# Altium schematic sheet 03-DRAM_Memory.SchDoc
size A4; Author: Fabian Castaño; CompanyName: GIBIC Tech-Hub; Engineer: Fabian Castaño; Organization: Universidad de Antioquia; Address1: UdeA; Address2: Medellín; Address3: Antioquia; Address4: Colombia 050010
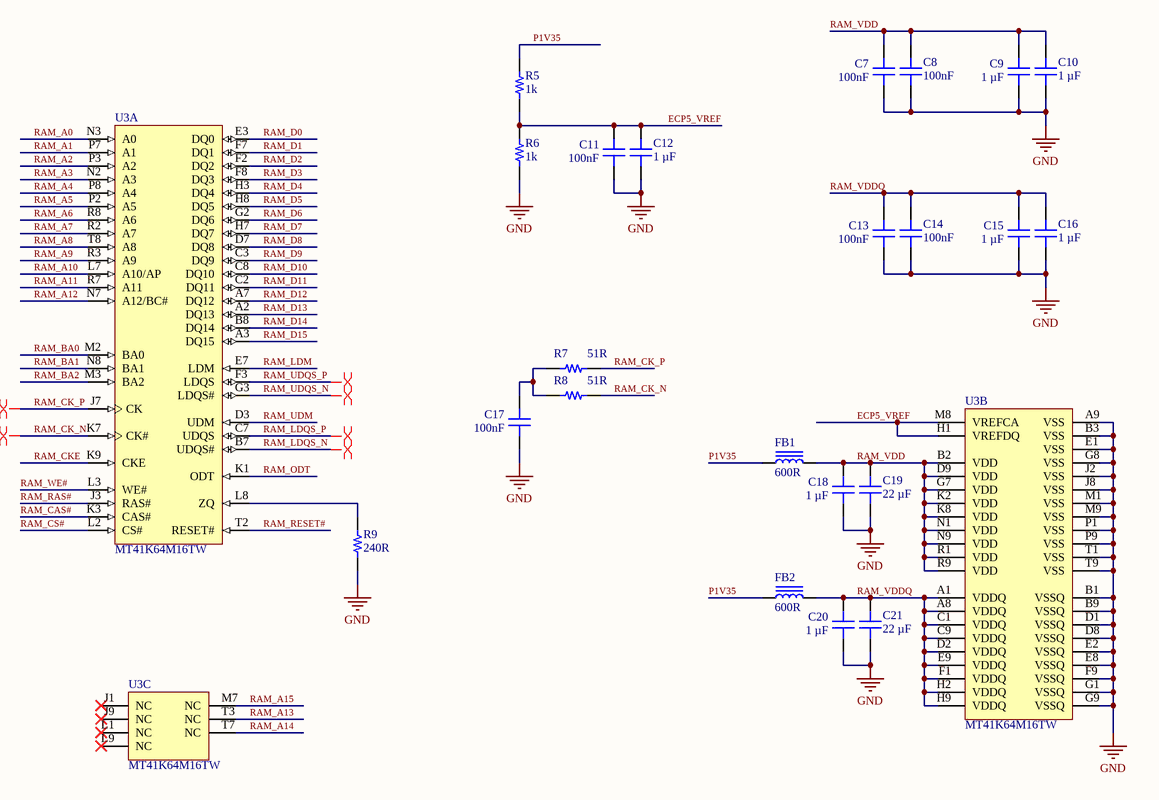
[diagram p0: 03-DRAM_Memory.SchDoc]

## Parts
C7  100nF  [CAP 0201_0603]
C8  100nF  [CAP 0201_0603]
C9  1 µF  [CAP 0402_1005]
C10  1 µF  [CAP 0402_1005]
C11  100nF  [CAP 0201_0603]
C12  1 µF  [CAP 0402_1005]
C13  100nF  [CAP 0201_0603]
C14  100nF  [CAP 0201_0603]
C15  1 µF  [CAP 0402_1005]
C16  1 µF  [CAP 0402_1005]
C17  100nF  [CAP 0201_0603]
C18  1 µF  [CAP 0402_1005]
C19  22 µF  [CAP 0603_1608]
C20  1 µF  [CAP 0402_1005]
C21  22 µF  [CAP 0603_1608]
FB1  600R  [IND 0402_1005 RF WW]
FB2  600R  [IND 0402_1005 RF WW]
R5  1k  [RES 0201_0603]
R6  1k  [RES 0201_0603]
R7  51R  [RES 0201_0603]
R8  51R  [RES 0201_0603]
R9  240R  [RES 0402_1005]
U3  MT41K64M16TW  [MICT-TW-96]  (parts A,B,C of 3)

## Nets
GND: C7.1 C8.1 C9.1 C10.1 C11.1 C12.1 C13.1 C14.1 C15.1 C16.1 C17.1 C18.1 C19.1 C20.1 C21.1 R6.2 R9.1 U3.A9(VSS) U3.B1(VSSQ) U3.B3(VSS) U3.B9(VSSQ) U3.D1(VSSQ) U3.D8(VSSQ) U3.E1(VSS) U3.E2(VSSQ) U3.E8(VSSQ) U3.F9(VSSQ) U3.G1(VSSQ) U3.G8(VSS) U3.G9(VSSQ) U3.J2(VSS) U3.J8(VSS) U3.M1(VSS) U3.M9(VSS) U3.P1(VSS) U3.P9(VSS) U3.T1(VSS) U3.T9(VSS)
ECP5_VREF: C11.2 C12.2 R5.2 R6.1 U3.H1(VREFDQ) U3.M8(VREFCA)
P1V35: FB1.1 FB2.1 R5.1
RAM_A0: U3.N3(A0)
RAM_A1: U3.P7(A1)
RAM_A2: U3.P3(A2)
RAM_A3: U3.N2(A3)
RAM_A4: U3.P8(A4)
RAM_A5: U3.P2(A5)
RAM_A6: U3.R8(A6)
RAM_A7: U3.R2(A7)
RAM_A8: U3.T8(A8)
RAM_A9: U3.R3(A9)
RAM_A10: U3.L7(A10/AP)
RAM_A11: U3.R7(A11)
RAM_A12: U3.N7(A12/BC#)
RAM_A13: U3.T3(NC)
RAM_A14: U3.T7(NC)
RAM_A15: U3.M7(NC)
RAM_BA0: U3.M2(BA0)
RAM_BA1: U3.N8(BA1)
RAM_BA2: U3.M3(BA2)
RAM_CAS#: U3.K3(CAS#)
RAM_CK_N: R8.2 U3.K7(CK#)
RAM_CK_P: R7.2 U3.J7(CK)
RAM_CKE: U3.K9(CKE)
RAM_CS#: U3.L2(CS#)
RAM_D0: U3.E3(DQ0)
RAM_D1: U3.F7(DQ1)
RAM_D2: U3.F2(DQ2)
RAM_D3: U3.F8(DQ3)
RAM_D4: U3.H3(DQ4)
RAM_D5: U3.H8(DQ5)
RAM_D6: U3.G2(DQ6)
RAM_D7: U3.H7(DQ7)
RAM_D8: U3.D7(DQ8)
RAM_D9: U3.C3(DQ9)
RAM_D10: U3.C8(DQ10)
RAM_D11: U3.C2(DQ11)
RAM_D12: U3.A7(DQ12)
RAM_D13: U3.A2(DQ13)
RAM_D14: U3.B8(DQ14)
RAM_D15: U3.A3(DQ15)
RAM_LDM: U3.E7(LDM)
RAM_LDQS_N: U3.B7(UDQS#)
RAM_LDQS_P: U3.C7(UDQS)
RAM_ODT: U3.K1(ODT)
RAM_RAS#: U3.J3(RAS#)
RAM_RESET#: U3.T2(RESET#)
RAM_UDM: U3.D3(UDM)
RAM_UDQS_N: U3.G3(LDQS#)
RAM_UDQS_P: U3.F3(LDQS)
RAM_VDD: C7.2 C8.2 C9.2 C10.2 C18.2 C19.2 FB1.2 U3.B2(VDD) U3.D9(VDD) U3.G7(VDD) U3.K2(VDD) U3.K8(VDD) U3.N1(VDD) U3.N9(VDD) U3.R1(VDD) U3.R9(VDD)
RAM_VDDQ: C13.2 C14.2 C15.2 C16.2 C20.2 C21.2 FB2.2 U3.A1(VDDQ) U3.A8(VDDQ) U3.C1(VDDQ) U3.C9(VDDQ) U3.D2(VDDQ) U3.E9(VDDQ) U3.F1(VDDQ) U3.H2(VDDQ) U3.H9(VDDQ)
RAM_WE#: U3.L3(WE#)
NetC17_2: C17.2 R7.1 R8.1
NetR9_2: R9.2 U3.L8(ZQ)

Not connected (* = marked no-connect by the designer): U3 J1(NC)* J9(NC)* L1(NC)* L9(NC)*

## Layout directives
differential pair: RAM_CK_N, RAM_CK_P, RAM_LDQS_N, RAM_LDQS_P, RAM_UDQS_N, RAM_UDQS_P

## Notes on the sheet
- Title
- Size:
- Date:
- A4
- Enginner:
- Time:
- Revision:
- Sheet
- of
- Author:
- File:

## Library data of the parts
C7 C8 C11 C13 C14 C17 = GRT033C80J104KE01J: CAP CER 0.1UF 6.3V X6S 0201; manufacturer: Murata Electronics; Capacitance: 0.1 µF; Tolerance: ±10%; Part Number: GRT033C80J104KE01J; Value: 100nF; Applications: Automotive; componentlink1description: Datasheet; componentlink1url: https://search.murata.co.jp/Ceramy/image/img/A01X/G101/ENG/GRT033C80J104KE01-01.pdf; componentlink2description: DigiKey Link; componentlink2url: https://www.digikey.com/en/products/detail/murata-electronics/GRT033C80J104KE01J/13905086; Device Package: 0201 (0603 Metric); lastupdated: 3/01/2023 8:00:58 p. m.; Lifecycle Status: Active; Minimum Order: 1; Mounting Type: Surface Mount, MLCC; Operating Temperature: -55°C ~ 105°C; Package / Case: 0201 (0603 Metric); packaging: CutTape; partid: 29730; Part Status: Active; price: 0.01; Ratings: AEC-Q200; series: GRT; Size / Dimension: 0.024" L x 0.012" W (0.60mm x 0.30mm); Supplier 1: DigiKey; Supplier Part Number 1: 490-GRT033C80J104KE01JCT-ND; Temperature Coefficient: X6S; Thickness (Max): 0.013" (0.33mm); Voltage - Rated: 6.3V
C9 C10 C12 C15 C16 C18 C20 = LMK105C6105KV-F: CAP CER 1UF 10V X6S 0402; manufacturer: Taiyo Yuden; Tolerance: ±10%; Part Number: LMK105C6105KV-F; Value: 1 µF; Applications: SMPS Filtering; Capacitance: 1 µF; componentlink1description: Datasheet; componentlink1url: https://www.yuden.co.jp/productdata/catalog/mlcc01_e.pdf; componentlink2description: DigiKey Link; componentlink2url: https://www.digikey.com/en/products/detail/taiyo-yuden/LMK105C6105KV-F/4157226; Device Package: 0402 (1005 Metric); lastupdated: 3/01/2023 8:04:17 p. m.; Lifecycle Status: Active; Minimum Order: 1; Mounting Type: Surface Mount, MLCC; Operating Temperature: -55°C ~ 105°C; Package / Case: 0402 (1005 Metric); packaging: TapeAndReel; partid: 2215; Part Status: Active; price: 0.01; series: M; Size / Dimension: 0.039" L x 0.020" W (1.00mm x 0.50mm); Supplier 1: DigiKey; Supplier Part Number 1: 587-3409-1-ND; Temperature Coefficient: X6S; Thickness (Max): 0.022" (0.55mm); Voltage - Rated: 10V
C19 C21 = GRM186R60J226ME15D: CAP CER 22UF 6.3V X5R 0603; manufacturer: Murata Electronics; Tolerance: ±20%; Part Number: GRM186R60J226ME15D; Value: 22 µF; Applications: General Purpose; Capacitance: 22 µF; componentlink1description: Datasheet; componentlink1url: https://psearch.en.murata.com/capacitor/product/GRM186R60J226ME15%23.pdf; componentlink2description: DigiKey Link; componentlink2url: https://www.digikey.com/en/products/detail/murata-electronics/GRM186R60J226ME15D/5877404; Device Package: 0603 (1608 Metric); lastupdated: 3/01/2023 8:07:48 p. m.; Lifecycle Status: Active; Minimum Order: 1; Mounting Type: Surface Mount, MLCC; Operating Temperature: -55°C ~ 85°C; Package / Case: 0603 (1608 Metric); packaging: TapeAndReel; partid: 2353; Part Status: Active; price: 0.06; series: GRM; Size / Dimension: 0.063" L x 0.031" W (1.60mm x 0.80mm); Supplier 1: DigiKey; Supplier Part Number 1: 490-13241-1-ND; Temperature Coefficient: X5R; Thickness (Max): 0.024" (0.60mm); Voltage - Rated: 6.3V
FB1 FB2 = LQW15AN4N8D8ZD: FIXED IND 4.8NH 1.2A 71MOHM SMD; Manufacturer: Murata Electronics; DC Resistance (DCR): 71mOhm Max; Frequency - Self Resonant: 8GHz; Inductance Frequency - Test: 100 MHz; Material - Core: Non-Magnetic; Q @ Freq: 30 @ 250MHz; Shielding: Unshielded; Tolerance: ±0.5nH; Type: Wirewound; Part Number: LQW15AN4N8D8ZD; ComponentLink1Description: Datasheet; ComponentLink1URL: https://search.murata.co.jp/Ceramy/image/img/P02/JELF243A-9138.pdf; ComponentLink2Description: DigiKey Link; ComponentLink2URL: https://www.digikey.com/en/products/detail/murata-electronics/LQW15AN4N8D8ZD/6798910; Current Rating (Amps): 1.2 A; Device Package: 0402 (1005 Metric); Height - Seated (Max): 0.024" (0.60mm); Inductance: 4.8 nH; LastUpdated: 2/01/2023 8:59:34 p. m.; Lifecycle Status: Active; Minimum Order: 1; Mounting Type: Surface Mount; Operating Temperature: -55°C ~ 125°C; Package / Case: 0402 (1005 Metric); Packaging: TapeAndReel; PartId: 2; Part Status: Active; Price: 0.08; Ratings: AEC-Q200; Series: LQW15; Size / Dimension: 0.039" L x 0.024" W (1.00mm x 0.60mm); Supplier 1: DigiKey; Supplier Part Number 1: 490-15485-1-ND; Value: 600R
R5-R8 = ERA-1AEB103C: RES SMD 10K OHM 0.1% 1/20W 0201; Manufacturer: Panasonic Electronic Components; Power (Watts): 0.05W, 1/20W; Resistance: 10 kOhms; Temperature Coefficient: ±25ppm/°C; Part Number: ERA-1AEB103C; ComponentLink1Description: Datasheet; ComponentLink1URL: https://industrial.panasonic.com/cdbs/www-data/pdf/RDM0000/AOA0000C307.pdf; ComponentLink2Description: DigiKey Link; ComponentLink2URL: https://www.digikey.com/en/products/detail/panasonic-electronic-components/ERA-1AEB103C/5035568; Composition: Thin Film; Device Package: 0201 (0603 Metric); Features: Automotive AEC-Q200; Height - Seated (Max): 0.010" (0.26mm); LastUpdated: 3/01/2023 8:15:23 p. m.; Lifecycle Status: Active; Minimum Order: 1; Number of Terminations: 2; Operating Temperature: -55°C ~ 155°C; Package / Case: 0201 (0603 Metric); Packaging: TapeAndReel; PartId: 598; Part Status: Active; Price: 0.06; Ratings: AEC-Q200; Series: ERA-1A; Size / Dimension: 0.024" L x 0.012" W (0.60mm x 0.30mm); Supplier 1: DigiKey; Supplier Part Number 1: P10KBXCT-ND; Supplier Device Package: 0201; Tolerance: ±0.1%
  R5 R6: Value: 1k
  R7 R8: Value: 51R
R9 = ERJ-2RKF1240X: RES SMD 124 OHM 1% 1/10W 0402; Manufacturer: Panasonic Electronic Components; Power (Watts): 0.1W, 1/10W; Resistance: 124 Ohms; Temperature Coefficient: ±100ppm/°C; Part Number: ERJ-2RKF1240X; Value: 240R; ComponentLink1Description: Datasheet; ComponentLink1URL: https://industrial.panasonic.com/cdbs/www-data/pdf/RDA0000/AOA0000C304.pdf; ComponentLink2Description: DigiKey Link; ComponentLink2URL: https://www.digikey.com/en/products/detail/panasonic-electronic-components/ERJ-2RKF1240X/192112; Composition: Thick Film; Device Package: 0402 (1005 Metric); Features: Automotive AEC-Q200; Height - Seated (Max): 0.016" (0.40mm); LastUpdated: 2/01/2023 8:21:47 p. m.; Lifecycle Status: Active; Minimum Order: 1; Number of Terminations: 2; Operating Temperature: -55°C ~ 155°C; Package / Case: 0402 (1005 Metric); Packaging: CutTape; PartId: 3785; Part Status: Active; Price: 0.01; Ratings: AEC-Q200; Series: ERJ-2RK; Size / Dimension: 0.039" L x 0.020" W (1.00mm x 0.50mm); Supplier 1: DigiKey; Supplier Part Number 1: P124LCT-ND; Supplier Device Package: 0402; Tolerance: ±1%
U3 = MT41K64M16TW: DDR3L SDRAM, 8 Meg x 16 x 8 Bank, 1.07 ns, 0 to 95 degC, 96-Ball FBGA (TW), Pb-Free